# Altium schematic sheet Sheet1_Connections.SchDoc
size A4; SheetNumber: 1; SheetTotal: 5
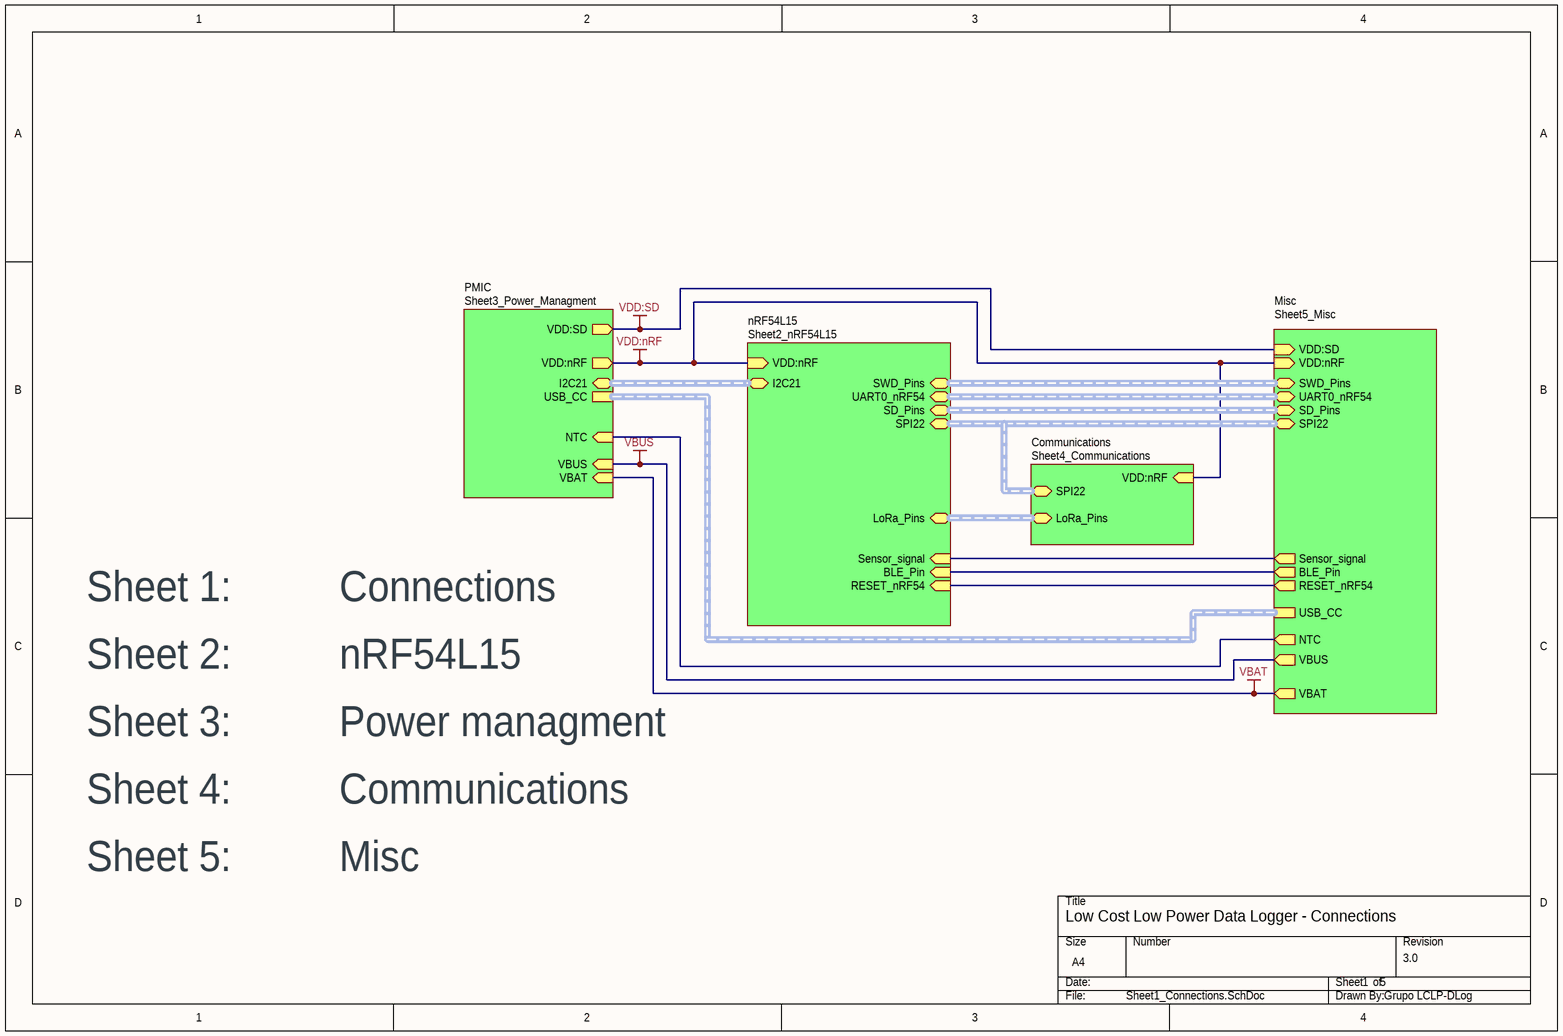
[diagram p0: Sheet1_Connections.SchDoc]

## Sub-sheets
Communications = Sheet4_Communications: SPI22 (bidir), LoRa_Pins (bidir), VDD:nRF (in)
Misc = Sheet5_Misc: SWD_Pins (bidir), UART0_nRF54 (bidir), SD_Pins (bidir), RESET_nRF54 (out), SPI22 (bidir), BLE_Pin (out), Sensor_signal (out), USB_CC, NTC (out), VBUS (out), VBAT (out), VDD:nRF (in), VDD:SD (in)
nRF54L15 = Sheet2_nRF54L15: I2C21 (bidir), SPI22 (bidir), LoRa_Pins (bidir), SD_Pins (bidir), UART0_nRF54 (bidir), SWD_Pins (bidir), RESET_nRF54 (in), Sensor_signal (in), BLE_Pin (in), VDD:nRF (in)
PMIC = Sheet3_Power_Managment: I2C21 (bidir), USB_CC, NTC (in), VBUS (in), VBAT (in), VDD:nRF (out), VDD:SD (out)

## Nets
VBAT: sheet PMIC/VBAT, sheet Misc/VBAT
VBUS: sheet PMIC/VBUS, sheet Misc/VBUS
VDD:nRF: sheet nRF54L15/VDD:nRF, sheet PMIC/VDD:nRF, sheet Communications/VDD:nRF, sheet Misc/VDD:nRF
VDD:SD: sheet PMIC/VDD:SD, sheet Misc/VDD:SD
(unnamed): sheet nRF54L15/RESET_nRF54, sheet Misc/RESET_nRF54
(unnamed): sheet nRF54L15/Sensor_signal, sheet Misc/Sensor_signal
(unnamed): sheet nRF54L15/BLE_Pin, sheet Misc/BLE_Pin
(unnamed): sheet PMIC/NTC, sheet Misc/NTC

## Buses and harness runs
harness sheet Communications/LoRa_Pins = sheet nRF54L15/LoRa_Pins
harness sheet Communications/SPI22 = sheet Misc/SPI22 = sheet nRF54L15/SPI22
harness sheet Misc/SD_Pins = sheet nRF54L15/SD_Pins
harness sheet Misc/SWD_Pins = sheet nRF54L15/SWD_Pins
harness sheet Misc/UART0_nRF54 = sheet nRF54L15/UART0_nRF54
harness sheet Misc/USB_CC = sheet PMIC/USB_CC
harness sheet nRF54L15/I2C21 = sheet PMIC/I2C21

## Notes on the sheet
- Sheet 1:          Connections
- Sheet 2:          nRF54L15
- Sheet 3:          Power managment
- Sheet 4:          Communications
- Sheet 5:          Misc
- Low Cost Low Power Data Logger - Connections
- 1
- 5
- 3.0
- Grupo LCLP-DLog